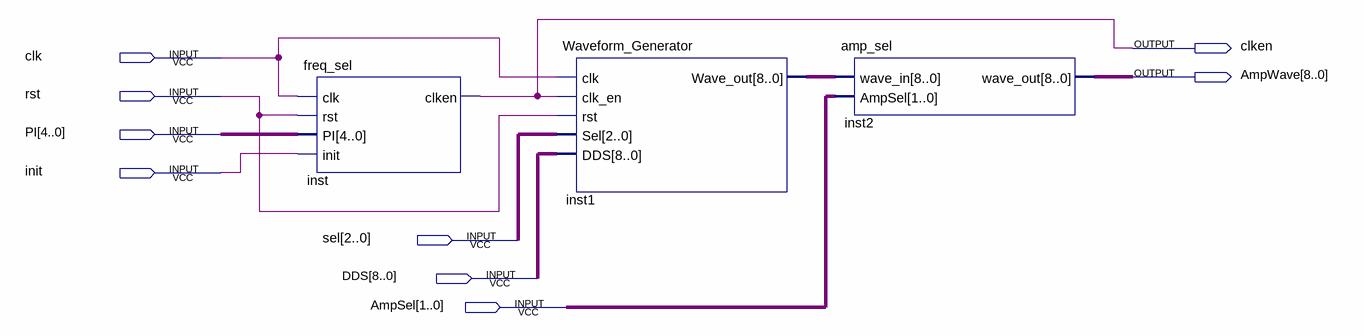
[diagram p0: schematic sheet]
// Quartus schematic Top.bdf as structural Verilog: 3 symbols, 9 pins
module Top (
  input  clk,
  input  rst,
  input  [4:0] PI,
  input  init,
  input  [2:0] sel,
  input  [8:0] DDS,
  input  [1:0] AmpSel,
  output clken,
  output [8:0] AmpWave
);

  wire [8:0] inst1_wave_out;

  freq_sel inst (.clk(clk), .rst(rst), .PI(PI), .init(init), .clken(clken));
  Waveform_Generator inst1 (.clk(clk), .clk_en(clken), .rst(rst), .Sel(sel), .DDS(DDS), .Wave_out(inst1_wave_out));
  amp_sel inst2 (.wave_in(inst1_wave_out), .AmpSel(AmpSel), .wave_out(AmpWave));
endmodule
